# Altium schematic sheet FPGA_80A_SerialO.SchDoc
size B; Organization: Altium Limited; Address1: L3, 12a Rodborough Rd; Address2: Frenchs Forest; Address3: NSW; Address4: Australia 2086; DocumentNumber: 5; SheetNumber: 1; SheetTotal: 5
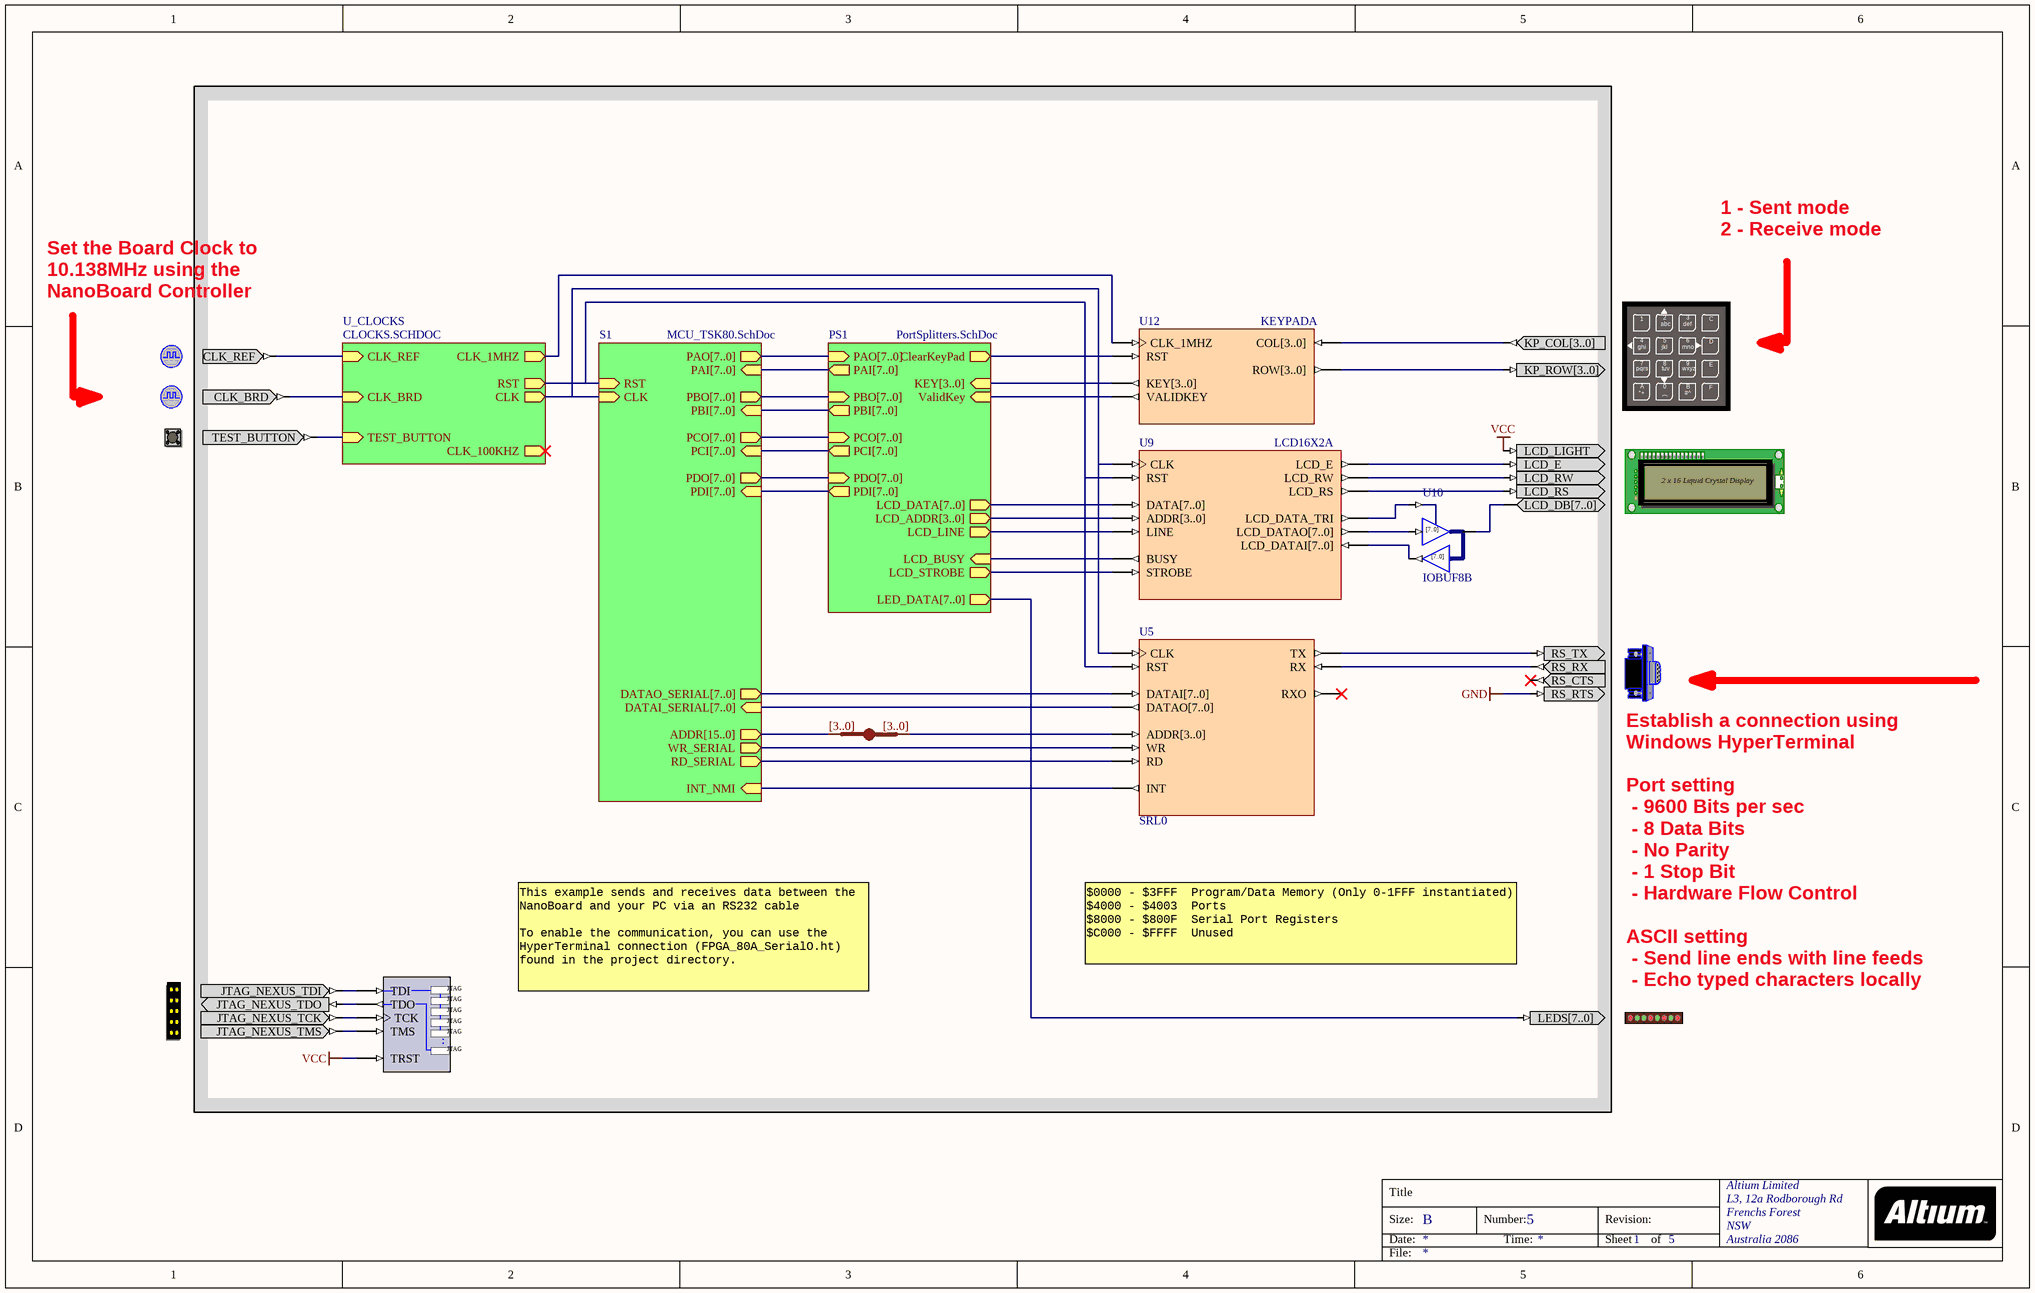
[diagram p0: FPGA_80A_SerialO.SchDoc]

## Parts
(Parts that share a designator on the sheet are numbered #1, #2 ... from top to bottom, then left to right.)
?#1  KEYPAD  (value not drawn)
?#2  CLOCK_REFERENCE  (value not drawn)
?#3  CLOCK_BOARD  (value not drawn)
?#4  TEST_BUTTON  (value not drawn)
?#5  LCD  (value not drawn)
?#6  RS232CNTR  (value not drawn)
?#7  NEXUS_JTAG_CONNECTOR  (value not drawn)
?#8  LED  (value not drawn)
JB_AUTO?  IndexA: [3..0]  (hidden comment: JB)
NEXUS_JTAG_PORT  NEXUS_JTAG_PORT  (value not drawn)
U5  SRL0
U9  LCD16X2A
U10  IOBUF8B
U12  KEYPADA

## Sub-sheets
PS1 = PortSplitters.SchDoc: PCO[7..0] (in), PBI[7..0] (out), PAI[7..0] (out), PAO[7..0] (in), PBO[7..0] (in), KEY[3..0] (in), PDO[7..0] (in), ValidKey (in), ClearKeyPad (out), PDI[7..0] (out), PCI[7..0] (out), LCD_ADDR[3..0] (out), LCD_DATA[7..0] (out), LCD_LINE (out), LCD_STROBE (out), LCD_BUSY (in), LED_DATA[7..0] (out)
S1 = MCU_TSK80.SchDoc: RST (in), INT_NMI (in), PAI[7..0] (in), PDI[7..0] (in), DATAI_SERIAL[7..0] (in), RD_SERIAL (out), PCO[7..0] (out), PBI[7..0] (in), PAO[7..0] (out), PDO[7..0] (out), PBO[7..0] (out), PCI[7..0] (in), WR_SERIAL (out), DATAO_SERIAL[7..0] (out), CLK (in), ADDR[15..0] (out)
U_CLOCKS = CLOCKS.SCHDOC: CLK_REF (in), CLK_BRD (in), TEST_BUTTON (in), RST (out), CLK_100KHZ (out), CLK_1MHZ (out), CLK (out)

## Nets
GND: ?#6.RS_RTS
VCC: ?#5.LCD_LIGHT NEXUS_JTAG_PORT.TRST
Net?#1_KP_COL[3..0]: ?#1.KP_COL[3..0] U12.COL[3..0]
Net?#1_KP_ROW[3..0]: ?#1.KP_ROW[3..0] U12.ROW[3..0]
Net?#2_CLK_REF: ?#2.CLK_REF ; sheet U_CLOCKS/CLK_REF
Net?#3_CLK_BRD: ?#3.CLK_BRD ; sheet U_CLOCKS/CLK_BRD
Net?#4_TEST_BUTTON: ?#4.TEST_BUTTON ; sheet U_CLOCKS/TEST_BUTTON
Net?#5_LCD_DB[7..0]: ?#5.LCD_DB[7..0] U10.IO[7..0]
Net?#5_LCD_E: ?#5.LCD_E U9.LCD_E
Net?#5_LCD_RS: ?#5.LCD_RS U9.LCD_RS
Net?#5_LCD_RW: ?#5.LCD_RW U9.LCD_RW
Net?#6_RS_RX: ?#6.RS_RX U5.RX
Net?#6_RS_TX: ?#6.RS_TX U5.TX
Net?#7_JTAG_NEXUS_TCK: ?#7.JTAG_NEXUS_TCK NEXUS_JTAG_PORT.TCK
Net?#7_JTAG_NEXUS_TDI: ?#7.JTAG_NEXUS_TDI NEXUS_JTAG_PORT.TDI
Net?#7_JTAG_NEXUS_TDO: ?#7.JTAG_NEXUS_TDO NEXUS_JTAG_PORT.TDO
Net?#7_JTAG_NEXUS_TMS: ?#7.JTAG_NEXUS_TMS NEXUS_JTAG_PORT.TMS
Net?#8_LEDS[7..0]: ?#8.LEDS[7..0] ; sheet PS1/LED_DATA[7..0]
NetJB_AUTO?_A[0..0]: JB_AUTO?.A[0..0] ; sheet S1/ADDR[15..0]
NetJB_AUTO?_B[0..0]: JB_AUTO?.B[0..0] U5.ADDR[3..0]
NetU5_CLK: U5.CLK U9.CLK ; sheet S1/CLK, sheet U_CLOCKS/CLK
NetU5_DATAI[7..0]: U5.DATAI[7..0] ; sheet S1/DATAO_SERIAL[7..0]
NetU5_DATAO[7..0]: U5.DATAO[7..0] ; sheet S1/DATAI_SERIAL[7..0]
NetU5_INT: U5.INT ; sheet S1/INT_NMI
NetU5_RD: U5.RD ; sheet S1/RD_SERIAL
NetU5_RST: U5.RST U9.RST ; sheet S1/RST, sheet U_CLOCKS/RST
NetU5_WR: U5.WR ; sheet S1/WR_SERIAL
NetU9_ADDR[3..0]: U9.ADDR[3..0] ; sheet PS1/LCD_ADDR[3..0]
NetU9_BUSY: U9.BUSY ; sheet PS1/LCD_BUSY
NetU9_DATA[7..0]: U9.DATA[7..0] ; sheet PS1/LCD_DATA[7..0]
NetU9_LCD_DATA_TRI: U9.LCD_DATA_TRI U10.T
NetU9_LCD_DATAI[7..0]: U9.LCD_DATAI[7..0] U10.O[7..0]
NetU9_LCD_DATAO[7..0]: U9.LCD_DATAO[7..0] U10.I[7..0]
NetU9_LINE: U9.LINE ; sheet PS1/LCD_LINE
NetU9_STROBE: U9.STROBE ; sheet PS1/LCD_STROBE
NetU12_CLK_1MHZ: U12.CLK_1MHZ ; sheet U_CLOCKS/CLK_1MHZ
NetU12_KEY[3..0]: U12.KEY[3..0] ; sheet PS1/KEY[3..0]
NetU12_RST: U12.RST ; sheet PS1/ClearKeyPad
NetU12_VALIDKEY: U12.VALIDKEY ; sheet PS1/ValidKey

Not connected (* = marked no-connect by the designer): ?#6 RS_CTS*; U5 RXO*

## Buses and harness runs
bus sheet PS1/PAI[7..0] = sheet S1/PAI[7..0]
bus sheet PS1/PAO[7..0] = sheet S1/PAO[7..0]
bus sheet PS1/PBI[7..0] = sheet S1/PBI[7..0]
bus sheet PS1/PBO[7..0] = sheet S1/PBO[7..0]
bus sheet PS1/PCI[7..0] = sheet S1/PCI[7..0]
bus sheet PS1/PCO[7..0] = sheet S1/PCO[7..0]
bus sheet PS1/PDI[7..0] = sheet S1/PDI[7..0]
bus sheet PS1/PDO[7..0] = sheet S1/PDO[7..0]

## Notes on the sheet
- 1 - Sent mode
  2 - Receive mode
- Set the Board Clock to 10.138MHz using the NanoBoard Controller
- $0000 - $3FFF  Program/Data Memory (Only 0-1FFF instantiated)
  $4000 - $4003  Ports
  $8000 - $800F  Serial Port Registers
  $C000 - $FFFF  Unused
- This example sends and receives data between the NanoBoard and your PC via an RS232 cable
  To enable the communication, you can use the HyperTerminal connection (FPGA_80A_SerialO.ht) found in the project directory.
- Establish a connection using Windows HyperTerminal
  Port setting
  - 9600 Bits per sec
  - 8 Data Bits
  - No Parity
  - 1 Stop Bit
  - Hardware Flow Control
  ASCII setting
  - Send line ends with line feeds
  - Echo typed characters locally
- Title
- Size:
- Date:
- B
- Number:
- Time:
- Revision:
- Sheet
- of
- File:
- (in symbol IOBUF8B) [7..0]
- (in symbol KEYPAD) 1; 2; 3; C; abc; def; 4; 5; 6; ghi; jkl; mno; D; 7; 8; 9; E; pqrs; tuv; wxyz; A; 0; B; F; *+; (; #^
- (in symbol LCD) 2 x 16 Liquid Crystal Display
- (in symbol NEXUS_JTAG_PORT) JTAG; .

## Library data of the parts
?#1 = KEYPAD: Key Pad; PortComponent: True; Published: 19-Nov-2003; Publisher: Altium Limited
?#2 = CLOCK_REFERENCE: Global System Clock Reference Supply; PortComponent: True; Published: 19-Nov-2003; Publisher: Altium Limited
?#3 = CLOCK_BOARD: Global System Clock Supply; PortComponent: True; Published: 19-Nov-2003; Publisher: Altium Limited
?#4 = TEST_BUTTON: Test Button; PortComponent: True; Published: 19-Nov-2003; Publisher: Altium Limited
?#5 = LCD: Liquid Crystal Display; PortComponent: True; Published: 19-Nov-2003; Publisher: Altium Limited
?#6 = RS232CNTR: DCE Serial Port Connector; PortComponent: True; Published: 19-Nov-2003; Publisher: Altium Limited
?#7 = NEXUS_JTAG_CONNECTOR: JTAG Port; PortComponent: True; Published: 19-Nov-2003; Publisher: Altium Limited
?#8 = LED: 8-Way LEDS; PortComponent: True; Published: 19-Nov-2003; Publisher: Altium Limited
JB_AUTO? = JB: System BUS Joiner; ArchiveName: GENERIC; Published: 18-Dec-2003; Publisher: Altium Limited; Core Revision: 1.00.00; IndexB: [3..0]
NEXUS_JTAG_PORT = NEXUS_JTAG_PORT: Soft Nexus-Chain Connector; NEXUS_JTAG_CONNECTOR: True; Published: 18-Dec-2003; Publisher: Altium Limited
U5 = SRL0: Serial 0; Published: 7/01/2004; Publisher: Altium Hobart Technology Centre; Core Revision: 1.00.00
U9 = LCD16X2A: LCD Controller; Published: 5/01/2004; Publisher: Altium Hobart Technology Centre; Core Revision: 1.00.00
U10 = IOBUF8B: 8-Bit Input/Output Buffer, Bus Version; SubClass: IOBUF; Enable: Low; Control: Common Control T; PortSize: 8; ArchiveName: GENERIC; VHDLIB_SIM: GENERIC_LIB; Published: 29-Jan-2004; Publisher: Altium Limited; LastRevisionNo: 1.00.00; HelpURL: CR0118 FPGA Generic Library Guide.pdf#page=292; FunctionalClass: Buffer; PortStyle: Bus Version
U12 = KEYPADA: Keypad; Published: 2/01/2004; Publisher: Altium Hobart Technology Centre; Core Revision: 1.00.00